# Altium schematic sheet Sheet_1_2022-01-04.schdoc
size 57 x 37 mm
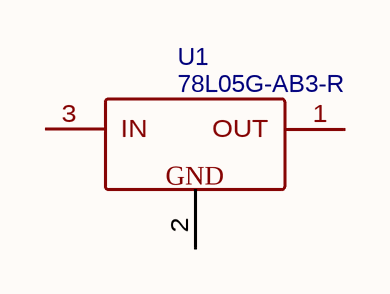
[diagram p0: Sheet_1_2022-01-04.schdoc]

## Parts
U1  78L05G-AB3-R  [SOT-89-3_L4.5-W2.5-P1.50-LS4.2-BR]

## Nets

Not connected (* = marked no-connect by the designer): U1 1(OUT) 2(GND) 3(IN)

## Library data of the parts
U1 = 78L05G-AB3-R: BOM_Manufacturer: UTC; BOM_Supplier: LCSC; BOM_Manufacturer Part: 78L05G-AB3-R; BOM_Supplier Part: C71136; BOM_JLCPCB Part Class: Basic Part; spicePre: U; spiceSymbolName: 78L05G-AB3-R